# Altium schematic sheet Sheet2[1].SchDoc
size A4
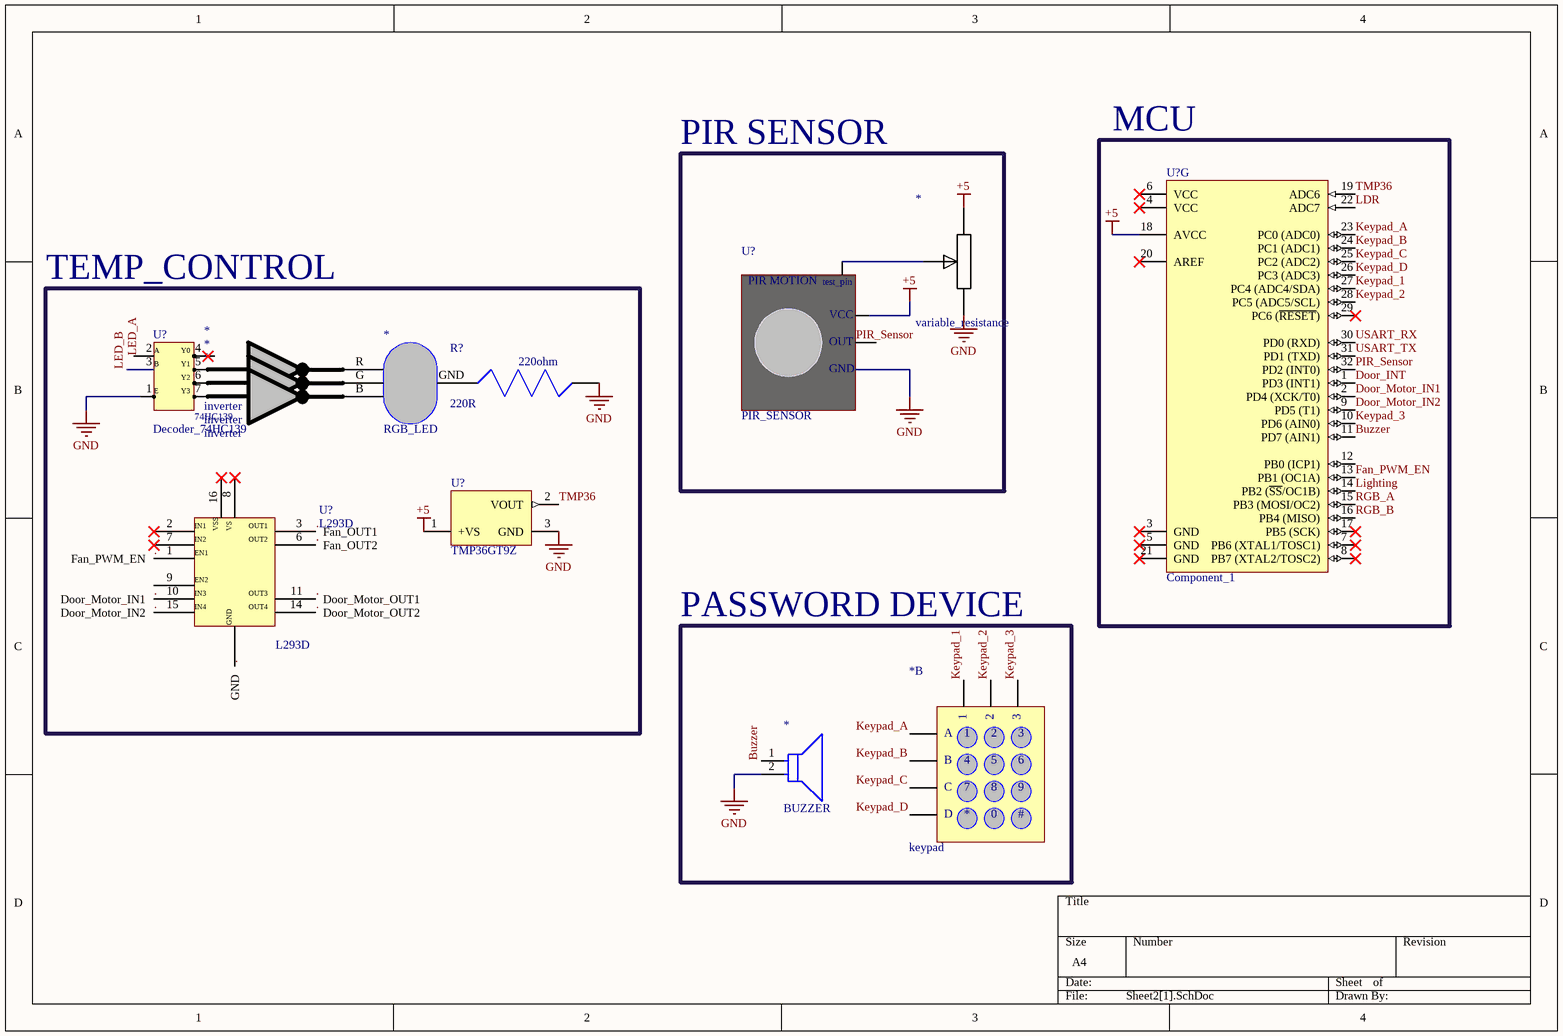
[diagram p0: Sheet2[1].SchDoc]

## Parts
(Parts that share a designator on the sheet are numbered #1, #2 ... from top to bottom, then left to right.)
*#1  variable_resistance
*#2  inverter
*#3  inverter
*#4  inverter
*#5  RGB_LED  [RGB_LED]
*#6  keypad  (part B of 5)
*#7  BUZZER
R?  220R  [220ohm]
U?#1  PIR_SENSOR
U?#2  Component_1  (part G of 7)
U?#3  Decoder_74HC139  [74HC139]
U?#4  TMP36GT9Z  [ADI-T-3]
U?#5  L293D  [L293D]

## Blocks framed on the sheet
PIR SENSOR: *#1 U?#1
MCU: U?#2
TEMP_CONTROL: *#2-*#5 R? U?#3-U?#5
PASSWORD DEVICE: *#6 *#7

## Nets
+5: U?#2.18(AVCC) U?#4.1(+VS)
GND: *#7.2(A) U?#4.3(GND)
Buzzer: *#7.1(C) U?#2.11(PD7_(AIN1))
Door_INT: U?#2.1(PD3_(INT1))
Door_Motor_IN1: U?#2.2(PD4_(XCK/T0))
Door_Motor_IN2: U?#2.9(PD5_(T1))
Fan_PWM_EN: U?#2.13(PB1_(OC1A))
Keypad_1: U?#2.27(PC4_(ADC4/SDA))
Keypad_2: U?#2.28(PC5_(ADC5/SCL))
Keypad_3: U?#2.10(PD6_(AIN0))
Keypad_A: U?#2.23(PC0_(ADC0))
Keypad_B: U?#2.24(PC1_(ADC1))
Keypad_C: U?#2.25(PC2_(ADC2))
Keypad_D: U?#2.26(PC3_(ADC3))
LDR: U?#2.22(ADC7)
LED_B: U?#3.3
Lighting: U?#2.14(PB2_(~{SS}/OC1B))
PIR_Sensor: U?#2.32(PD2_(INT0))
RGB_A: U?#2.15(PB3_(MOSI/OC2))
RGB_B: U?#2.16(PB4_(MISO))
TMP36: U?#2.19(ADC6) U?#4.2(VOUT)
USART_RX: U?#2.30(PD0_(RXD))
USART_TX: U?#2.31(PD1_(TXD))

Not connected (* = marked no-connect by the designer): *#5 B G GND R; U?#1 Test_pin(test_pin); U?#2 3(GND)* 4(VCC)* 5(GND)* 6(VCC)* 7(PB6_(XTAL1/TOSC1))* 8(PB7_(XTAL2/TOSC2))* 12(PB0_(ICP1)) 17(PB5_(SCK))* 20(AREF)* 21(GND)* 29(PC6_(~{RESET}))*; U?#3 1 2 4(16) 5(17) 6 7; U?#5 1(Fan_PWM_EN) 2(IN1) 3(Fan_OUT1) 6(Fan_OUT2) 7(IN2) 8(VS) 9(EN2) 10(Door_Motor_IN1) 11(Door_Motor_OUT1) 14(Door_Motor_OUT2) 15(Door_Motor_IN2) 16(VSS)

## Notes on the sheet
- Labels drawn without touching a wire or pin: +5, GND, Keypad_1, Keypad_2, Keypad_3, Keypad_A, Keypad_B, Keypad_C, Keypad_D, LED_A, PIR_Sensor
- (in symbol 220R) 220ohm
- (in symbol Decoder_74HC139) A; Y0; B; Y1; Y2; E; Y3; 74HC139
- (in symbol keypad, part B) 1; 2; 3; A; B; 4; 5; 6; C; 7; 8; 9; D; 0; #
- (in symbol L293D) OUT1; OUT2; EN1; IN3; OUT3; IN4; OUT4
- (in symbol PIR_SENSOR) PIR MOTION; VCC; OUT; GND

## Library data of the parts
*#5 = RGB_LED: Manufacturer: Lumex; MPN: SML-LX0404SIUPGUSB; SPN: *; Supplier: *
R? = 220R: Manufacturer: Murata; MPN: BLM18SG221TN1D; SPN: *; Supplier: *
U?#3 = Decoder_74HC139: Manufacturer: Texas Instruments; MPN: 74hc139; SPN: *; Supplier: *
U?#4 = CMP-0887-00067-1: Low Voltage Temperature Sensor, 2.7 to 5.5 V Supply, Industrial, 3-pin TO92 (T-3), Tray; Manufacturer: Analog Devices; ComponentLink2Description: Datasheet; PackageReference: T-3; Packing: Tray; ComponentLink2URL: http://www.analog.com/static/imported-files/data_sheets/TMP35_36_37.pdf; ComponentLink4Description: Product URL; ComponentLink3Description: Package Specification; Code_JEDEC: TO-226-AA; PartNumber: TMP36GT9Z; PackageDescription: 3-Pin Plastic Header-Style Package, 1.27 mm Pitch; PackageVersion: 042208-A, 04/2008; ComponentLink3URL: http://www.analog.com/static/imported-files/packages/PKG_PDF/TO-92(T)/T_3.pdf; ComponentLink1Description: Manufacturer URL; Supply Voltage Range: 2.7 to 5.5 V; Mounting Technology: Through Hole; DatasheetVersion: Rev. F; ComponentLink4URL: http://www.analog.com/en/mems-sensors/digital-temperature-sensors/tmp36/products/product.html; ComponentLink1URL: http://www.analog.com/en/index.html
U?#5 = L293D: Manufacturer: STMicroelectronics; MPN: L293D; SPN: *; Supplier: *